# Altium schematic sheet MAIN_CaseiroDuino.SchDoc
size A4
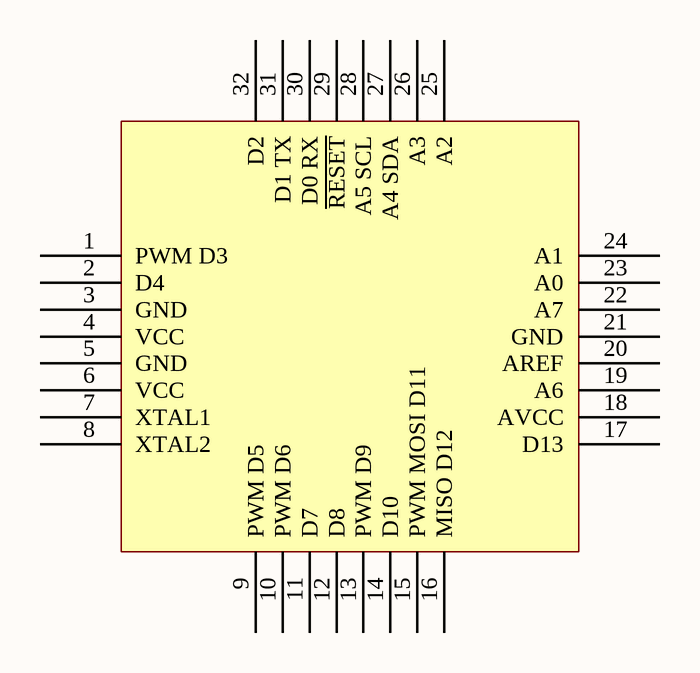
[diagram p0: MAIN_CaseiroDuino.SchDoc]

## Parts
U*  ATMEGA328P-AU  [TQFP80P900X900X120-32N]  (value not drawn)

## Nets

Not connected (* = marked no-connect by the designer): U* 1(PWM_D3) 2(D4) 3(GND) 4(VCC) 5(GND) 6(VCC) 7(XTAL1) 8(XTAL2) 9(PWM_D5) 10(PWM_D6) 11(D7) 12(D8) 13(PWM_D9) 14(D10) 15(PWM_MOSI_D11) 16(MISO_D12) 17(D13) 18(AVCC) 19(A6) 20(AREF) 21(GND) 22(A7) 23(A0) 24(A1) 25(A2) 26(A3) 27(A4_SDA) 28(A5_SCL) 29(~{RESET}) 30(D0_RX) 31(D1_TX) 32(D2)

## Library data of the parts
U* = ATMEGA328P-AU: ATMEGA328P-AU, 8bit AVR Microcontroller, 20MHz, 1 kB, 32 kB Flash, 32-Pin TQFP; Created By: Henrik Baltazar; Date Created: 27 January 2018; RS stock no.: 696-3092; Datasheet URL: http://docs-europe.electrocomponents.com/webdocs/0db4/0900766b80db4deb.pdf